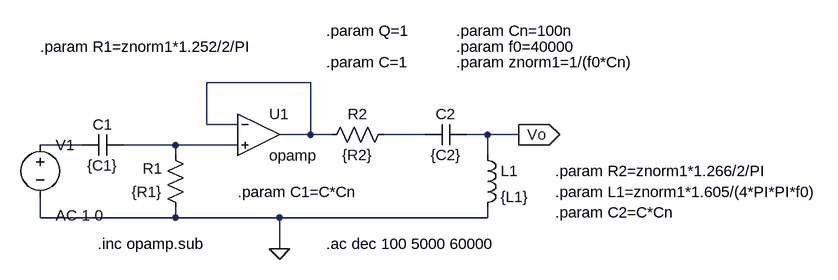
[diagram p0: schematic TS4.asc]
TS4.asc, the LTspice schematic file:
Version 4
SHEET 1 1328 680
WIRE 240 32 80 32
WIRE 80 96 80 32
WIRE 128 96 80 96
WIRE 240 112 240 32
WIRE 240 112 192 112
WIRE 272 112 240 112
WIRE 416 112 352 112
WIRE 512 112 480 112
WIRE 560 112 512 112
WIRE -112 128 -176 128
WIRE 32 128 -48 128
WIRE 128 128 32 128
WIRE 32 144 32 128
WIRE 512 144 512 112
WIRE -176 240 -176 208
WIRE 32 240 32 224
WIRE 32 240 -176 240
WIRE 192 240 32 240
WIRE 512 240 512 224
WIRE 512 240 192 240
WIRE 192 288 192 240
FLAG 192 288 0
FLAG 560 112 Vo
IOPIN 560 112 Out
SYMBOL res 48 240 R180
WINDOW 0 36 76 Left 2
WINDOW 3 36 40 Left 2
SYMATTR InstName R1
SYMATTR Value {R1}
SYMBOL res 368 96 R90
WINDOW 0 0 56 VBottom 2
WINDOW 3 32 56 VTop 2
SYMATTR InstName R2
SYMATTR Value {R2}
SYMBOL ind 496 128 R0
SYMATTR InstName L1
SYMATTR Value {L1}
SYMBOL cap -48 112 R90
WINDOW 0 0 32 VBottom 2
WINDOW 3 32 32 VTop 2
SYMATTR InstName C1
SYMATTR Value {C1}
SYMBOL cap 416 128 R270
WINDOW 0 32 32 VTop 2
WINDOW 3 0 32 VBottom 2
SYMATTR InstName C2
SYMATTR Value {C2}
SYMBOL voltage -176 112 R0
WINDOW 123 24 124 Left 2
WINDOW 39 0 0 Left 0
SYMATTR Value2 AC 1 0
SYMATTR InstName V1
SYMATTR Value ""
SYMBOL OpAmps\\opamp 160 48 R0
SYMATTR InstName U1
TEXT 264 280 Left 2 !.ac dec 100 5000 60000
TEXT -88 280 Left 2 !.inc opamp.sub
TEXT -176 -24 Left 2 !.param R1=znorm1*1.252/2/PI
TEXT 616 200 Left 2 !.param L1=znorm1*1.605/(4*PI*PI*f0)
TEXT 616 168 Left 2 !.param R2=znorm1*1.266/2/PI
TEXT 264 -48 Left 2 !.param Q=1
TEXT 264 0 Left 2 !.param C=1
TEXT 616 232 Left 2 !.param C2=C*Cn
TEXT 464 -48 Left 2 !.param Cn=100n
TEXT 464 -24 Left 2 !.param f0=40000
TEXT 464 0 Left 2 !.param znorm1=1/(f0*Cn)
TEXT 128 200 Left 2 !.param C1=C*Cn

The netlist it stands for:
* TS4.asc
R1 0 N004 {R1}
R2 N002 N001 {R2}
L1 Vo 0 {L1}
C1 N004 N003 {C1}
C2 N002 Vo {C2}
V1 N003 0 AC 1 0
XU1 N001 N004 N001 opamp Aol=100K GBW=10Meg  ; pins invin noninvin out
.ac dec 100 5000 60000
.inc opamp.sub
.param R1=znorm1*1.252/2/PI
.param L1=znorm1*1.605/(4*PI*PI*f0)
.param R2=znorm1*1.266/2/PI
.param Q=1
.param C=1
.param C2=C*Cn
.param Cn=100n
.param f0=40000
.param znorm1=1/(f0*Cn)
.param C1=C*Cn
.backanno
.end

* Results of the author's LTspice run, read from the files saved beside the schematic
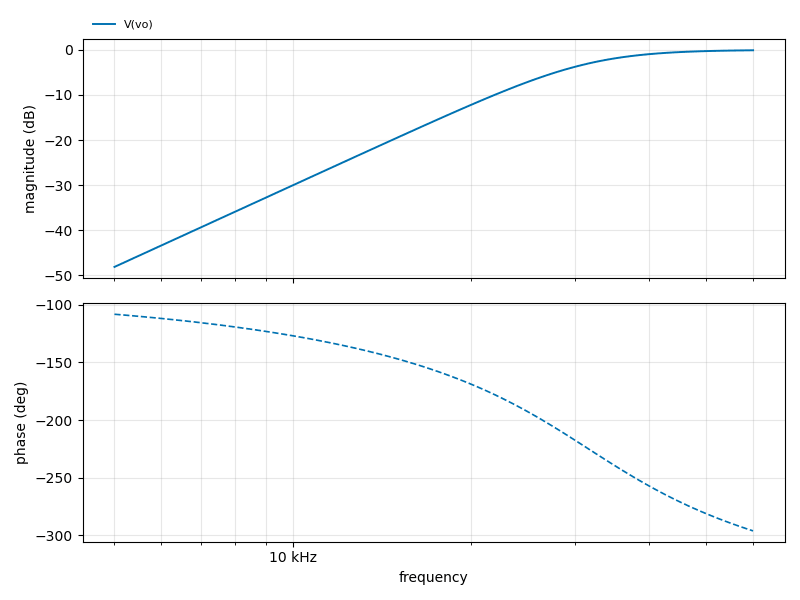
[diagram p1: AC Analysis of TS4.asc, plotted from the saved traces]
* AC Analysis, 1 run:
*   V(vo): -48.12 dB at 5 kHz, -0.11 dB at 60 kHz, peak -0.11 dB at 60 kHz, 3 dB below the peak at 31.42 kHz